# EAGLE design LCD-Micro-PC (EAGLE 6.5.0)
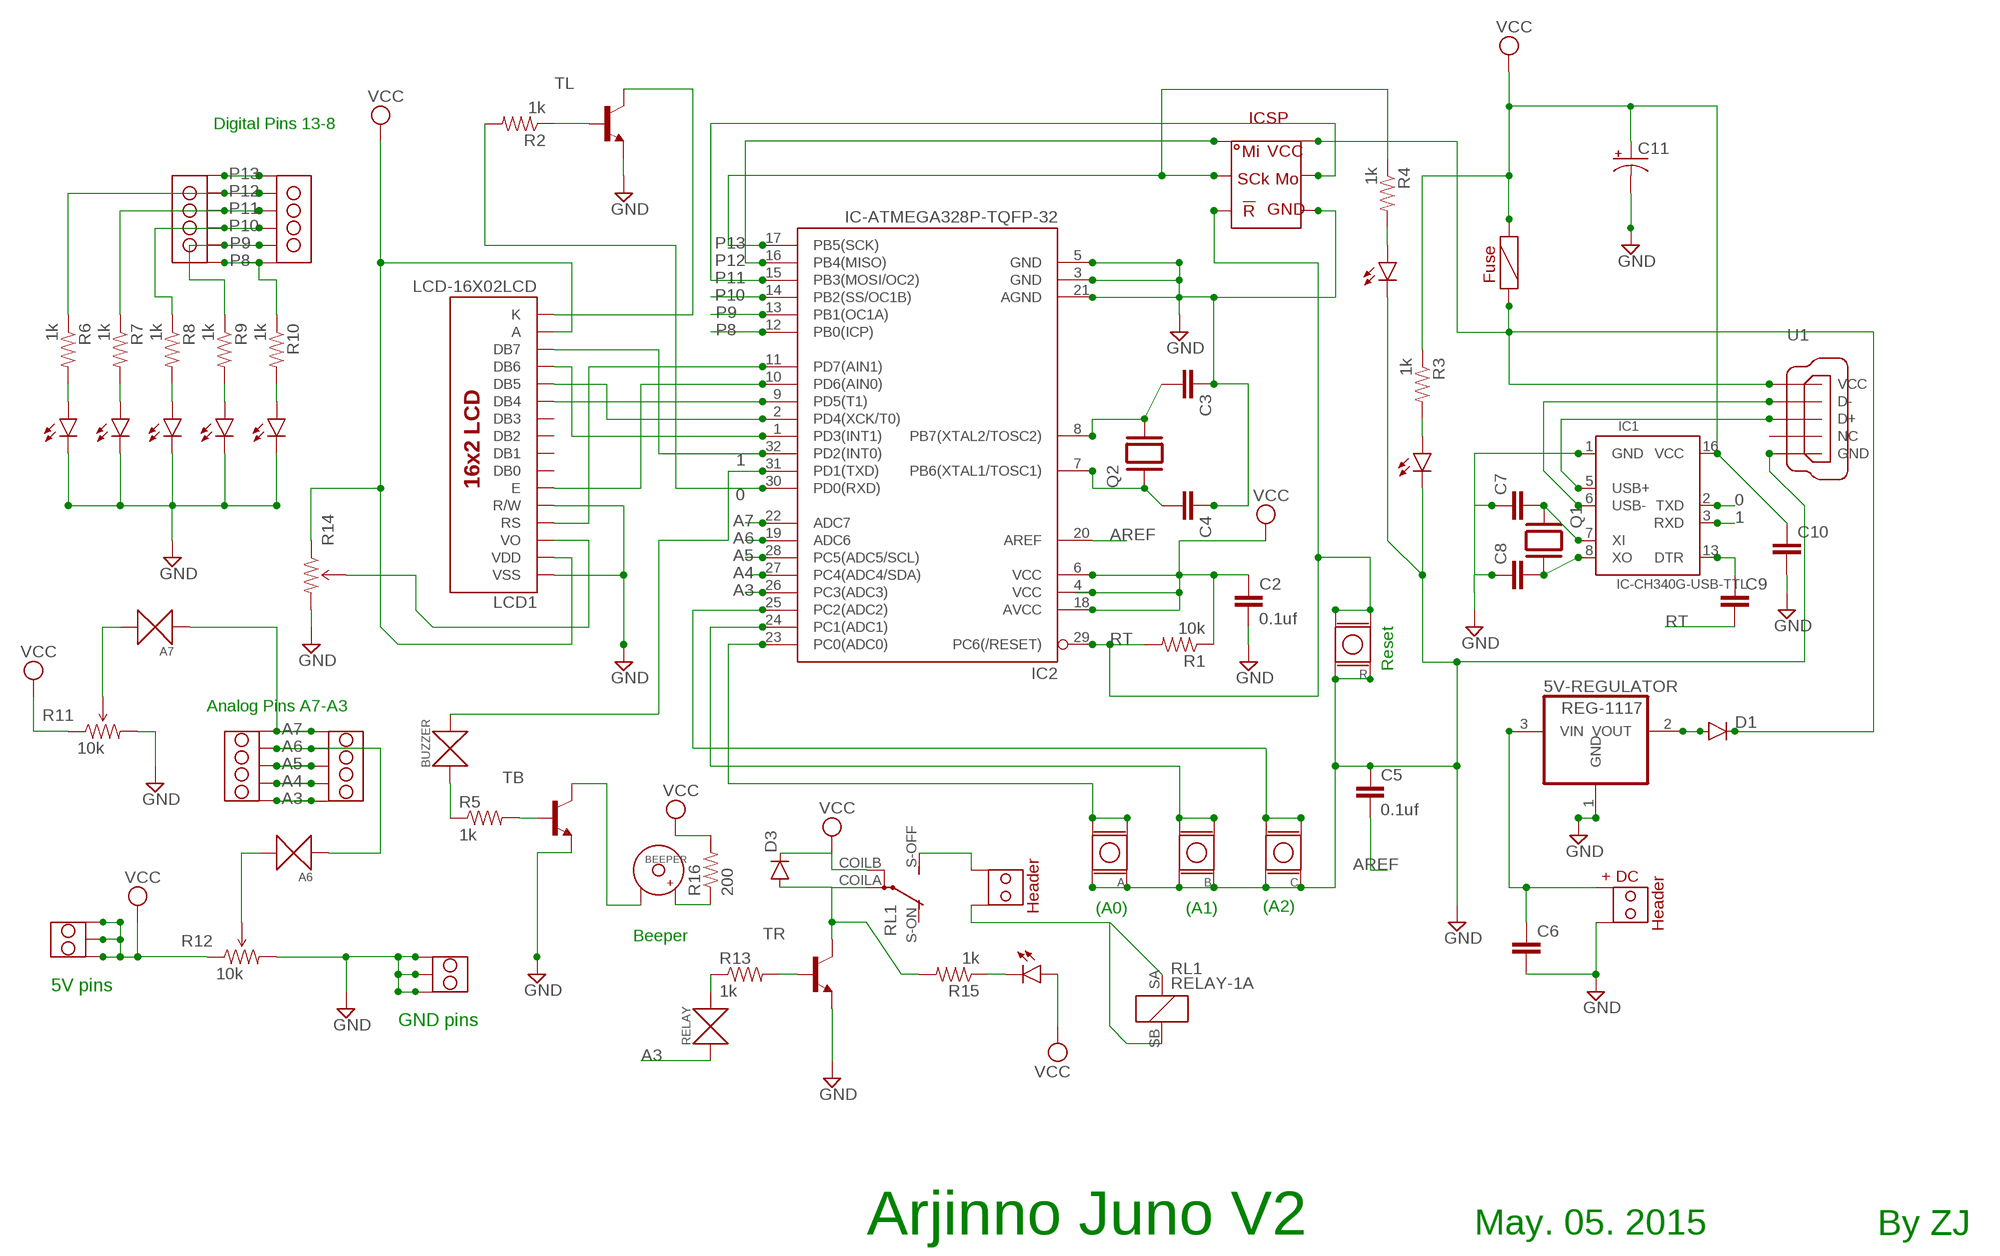
[diagram p0: schematic, sheet 1]

## Parts
5V-REGULATOR  REG-1117  [SOT-223@1]
A  BUTTON-6X6  [BUT-6X6]
A6  TRACE-0.6MM  [TRACE]
A7  TRACE-0.6MM  [TRACE]
B  BUTTON-6X6  [BUT-6X6]
BEEPER  BUZZER-12MM  [BUZ-12MM]
BUZZER  TRACE-0.6MM  [TRACE]
C  BUTTON-6X6  [BUT-6X6]
C2  0.1uf  CAP-0805  [0805]
C3  CAP-0805  [0805]
C4  CAP-0805  [0805]
C5  0.1uf  CAP-0805  [0805]
C6  CAP-0805  [0805]
C7  CAP-SMD-0805  [0805]
C8  CAP-SMD-0805  [0805]
C9  CAP-SMD-0805  [0805]
C10  CAP-SMD-0805  [0805]
C11  CAP-POL-6MM-SMD  [CAP-POL-6.3X7.7MM]
D1  DIODE-SMA-4MM  [DIODE-SMA]
D3  DIODE-SOD-1206  [SOD-1206]
FUSE  FUSE  [0805]
GND  HEADER-3P  [HEADER-3P]
H1  HEADER-2P  [HEADER-2P]
IC1  IC-CH340G-USB-TTL  [SOP-16]
IC2  IC-ATMEGA328P-TQFP-32  [TQFP32-08MM]
LCD1  LCD-16X02LCD  [LCD-1602]
LED1  LED-0805  [LED-0805]
LED3  LED-0805  [LED-0805]
LED4  LED-0805  [LED-0805]
LED6  LED-0805  [LED-0805]
LED7  LED-0805  [LED-0805]
LED8  LED-0805  [LED-0805]
LED9  LED-0805  [LED-0805]
LED10  LED-0805  [LED-0805]
Q1  CRYSTAL-5032  [CRYSTAL-5032]
Q2  CRYSTAL-5032  [CRYSTAL-5032]
R  BUTTON-4X4-SMD  [BUT-SMD-4X4]
R1  10k  RES-0805  [0805]
R2  1k  RES-0805  [0805]
R3  1k  RES-0805  [0805]
R4  1k  RES-0805  [0805]
R5  1k  RES-0805  [0805]
R6  1k  RES-0805  [0805]
R7  1k  RES-0805  [0805]
R8  1k  RES-0805  [0805]
R9  1k  RES-0805  [0805]
R10  1k  RES-0805  [0805]
R11  10k  POT-6MM-0505  [POT-5X5MM@1]
R12  10k  POT-10MM  [POT-10X10MM@1]
R13  1k  RES-0805  [0805]
R14  POTENTIOMETER-3MM-SMD  [POT-3MM-SMD]
R15  1k  RES-0805  [0805]
R16  200  RES-0805  [0805]
RELAY  TRACE-0.6MM  [TRACE]
RL1  RELAY-1A  [REL-G5V1]
TB  NPN-S8050-J3Y-0.3W  [SOT-23]
TL  NPN-S8050-J3Y-0.3W  [SOT-23]
TR  NPN-S8050-J3Y-0.3W  [SOT-23]
U1  USB-MINI  [USB-MINI]
U$1  ISCP-6PINS  [ISCP]
U$2  HEADER-2P-DC  [HEADER-2P-DC]
U$9  HEADER-5P  [HEADER-5P]
U$10  HEADER-6P  [HEADER-6P]
U$11  HEADER-6P  [HEADER-6P]
U$12  HEADER-5P  [HEADER-5P]
VCC  HEADER-3P  [HEADER-3P]

## Nets
0: IC1.2(TXD) IC2.30(PD0(RXD)) R2.2
1: BUZZER.P$2 IC1.3(RXD) IC2.31(PD1(TXD))
A3: IC2.26(PC3(ADC3)) RELAY.P$1 U$9.P$5 U$12.P$1
A4: IC2.27(PC4(ADC4/SDA)) U$9.P$4 U$12.P$2
A5: IC2.28(PC5(ADC5/SCL)) U$9.P$3 U$12.P$3
A6: A6.P$1 IC2.19(ADC6) U$9.P$2 U$12.P$4
A7: A7.P$1 IC2.22(ADC7) U$9.P$1 U$12.P$5
AREF: C5.2 IC2.20(AREF)
GND: 5V-REGULATOR.1(GND) A.B0 A.B1 B.B0 B.B1 C2.2 C3.1 C4.1 C5.1 C6.2 C7.1 C8.1 C10.2 C11.- C.B0 C.B1 GND.P$1 GND.P$2 GND.P$3 IC1.1(GND) IC2.3(GND) IC2.5(GND) IC2.21(AGND) LCD1.1(VSS) LCD1.5(R/W) LED3.C LED4.C LED6.C LED7.C LED8.C LED9.C LED10.C R11.3(CW) R12.3(CW) R14.3(CW) R.B1(B0) R.B2(B1) TB.2(E) TL.2(E) TR.2(E) U1.5(GND) U$1.P$4 U$2.-
N$1: IC2.32(PD2(INT0)) LCD1.14(DB7)
N$2: IC2.1(PD3(INT1)) LCD1.13(DB6)
N$3: IC2.2(PD4(XCK/T0)) LCD1.12(DB5)
N$4: IC2.9(PD5(T1)) LCD1.11(DB4)
N$6: LCD1.16(K) TL.3(C)
N$7: BUZZER.P$1 R5.1
N$8: R2.1 TL.1(B)
N$9: IC1.5(USB+) U1.3(D+)
N$10: LCD1.3(VO) R14.2(WIPER)
N$11: IC2.10(PD6(AIN0)) LCD1.6(E)
N$12: IC2.11(PD7(AIN1)) LCD1.4(RS)
N$13: A.A0 A.A1 IC2.23(PC0(ADC0))
N$14: B.A0 B.A1 IC2.24(PC1(ADC1))
N$15: C.A0 C.A1 IC2.25(PC2(ADC2))
N$16: LED3.A R3.2
N$17: BEEPER.- TB.3(C)
N$18: LED1.C R15.1
N$19: LED6.A R6.2
N$20: LED7.A R7.2
N$21: LED4.A R4.2
N$22: LED8.A R8.2
N$23: LED9.A R9.2
N$24: R5.2 TB.1(B)
N$25: LED10.A R10.2
N$26: C3.2 IC2.8(PB7(XTAL2/TOSC2)) Q2.2
N$27: C4.2 IC2.7(PB6(XTAL1/TOSC1)) Q2.1
N$28: 5V-REGULATOR.2(VOUT) D1.A
N$29: A7.P$2 R11.2(WIPER)
N$30: D3.A R15.2 RL1.COILA(P) TR.3(C)
N$31: 5V-REGULATOR.3(VIN) C6.1 U$2.+
N$32: H1.P$2(-) RL1.SA RL1.SB
N$33: A6.P$2 R12.2(WIPER)
N$34: H1.P$1(+) RL1.S-OFF(SW)
N$36: D1.C FUSE.1 U1.1(VCC) U$1.P$6
N$37: R13.2 TR.1(B)
N$38: IC1.6(USB-) U1.2(D-)
N$39: C7.2 IC1.7(XI) Q1.1
N$40: C8.2 IC1.8(XO) Q1.2
N$41: C9.1 IC1.13(DTR)
N$43: BEEPER.+ R16.1
N$45: R13.1 RELAY.P$2
P8: IC2.12(PB0(ICP)) R10.1 U$10.P$6 U$11.P$1
P9: IC2.13(PB1(OC1A)) R9.1 U$10.P$5 U$11.P$2
P10: IC2.14(PB2(SS/OC1B)) R8.1 U$10.P$4 U$11.P$3
P11: IC2.15(PB3(MOSI/OC2)) R7.1 U$1.P$5 U$10.P$3 U$11.P$4
P12: IC2.16(PB4(MISO)) R6.1 U$1.P$1 U$10.P$2 U$11.P$5
P13: IC2.17(PB5(SCK)) R4.1 U$1.P$2 U$10.P$1 U$11.P$6
RT: C9.2 IC2.29(PC6(/RESET)) R1.2 R.A0 R.A1 U$1.P$3
VCC: C2.1 C10.1 C11.+ D3.C FUSE.2 IC1.16(VCC) IC2.4(VCC) IC2.6(VCC) IC2.18(AVCC) LCD1.2(VDD) LCD1.15(A) LED1.A R1.1 R3.1 R11.1(CCW) R12.1(CCW) R14.1(CCW) R16.2 RL1.COILB(P) VCC.P$1 VCC.P$2 VCC.P$3
Unconnected: LCD1.7(DB0) LCD1.8(DB1) LCD1.9(DB2) LCD1.10(DB3) RL1.S-ON(ON) U1.4(NC)

## Notes on the sheet
- Digital Pins 13-8
- Reset
- Analog Pins A7-A3
- (A0) | (A1) | (A2)
- Beeper
- 5V pins
- GND pins
- Arjinno Juno V2 | May. 05. 2015 | By ZJ

## Library data of the parts
5V-REGULATOR = - Jins eagle lbr:REG-1117: 800mA and 1A Low Dropout (LDO) Positive Regulator 1.8V, 2.5V, 2.85V, 3.3V, 5V, and Adj; MPN: REG1117; OC_FARNELL: 1097566; OC_NEWARK: 14P6981
A B C R = - Jins eagle lbr:BUTTON
A6 A7 BUZZER RELAY = - Jins eagle lbr:TRACE
BEEPER = - Jins eagle lbr:BUZZER-12MM
C2-C6 = - Jins eagle lbr:CAP-0805
C7-C10 = - Jins eagle lbr:CAP-SMD
C11 = - Jins eagle lbr:CAP-POL
D1 D3 = - Jins eagle lbr:DIODE: Diode These are standard reverse protection diodes and small signal diodes. SMA package can handle up to about 1A. SOD-323 can handle about 200mA. What the SOD-323 package when ordering, there are some mfgs out there that are 5-pin packages.
FUSE = - Jins eagle lbr:FUSE
GND VCC = - Jins eagle lbr:HEADER-3P
H1 = - Jins eagle lbr:HEADER-2P
IC1 = - Jins eagle lbr:IC-CH340G
IC2 = - Jins eagle lbr:IC-ATMEGA328P-TQFP-32
LCD1 = - Jins eagle lbr:LCD-16X02
LED1 LED3 LED4 LED6-LED10 = - Jins eagle lbr:LED
Q1 Q2 = - Jins eagle lbr:CRYSTAL: CRYSTAL
R1-R10 R13 R15 R16 = - Jins eagle lbr:RES-0805
R11 = - Jins eagle lbr:POT-6MM-0505
R12 = - Jins eagle lbr:POT-10MM
R14 = - Jins eagle lbr:POTENTIOMETER
RL1 = - Jins eagle lbr:RELAY
TB TL TR = - Jins eagle lbr:NPN
U1 = - Jins eagle lbr:USB-MINI
U$1 = - Jins eagle lbr:ISCP
U$2 = - Jins eagle lbr:HEADER-2P-DC
U$9 U$12 = - Jins eagle lbr:HEADER-5P
U$10 U$11 = - Jins eagle lbr:HEADER-6P

## Board
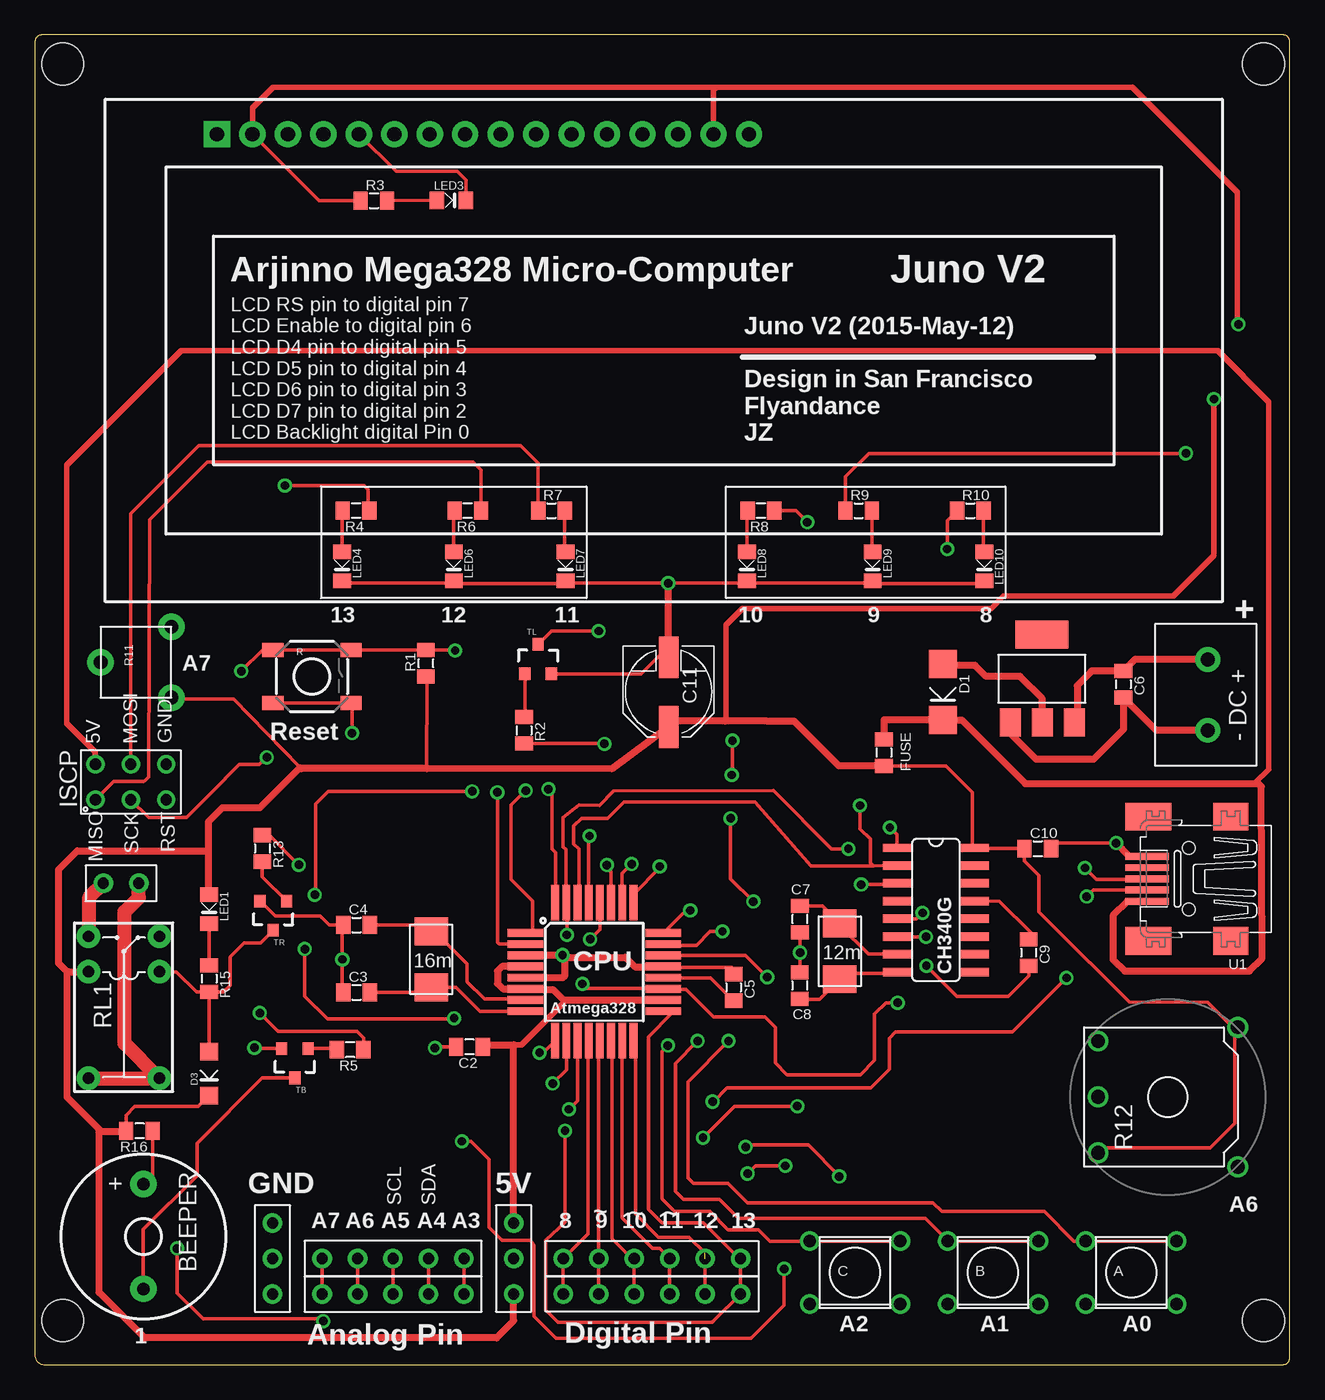
[diagram p1: board, top side]
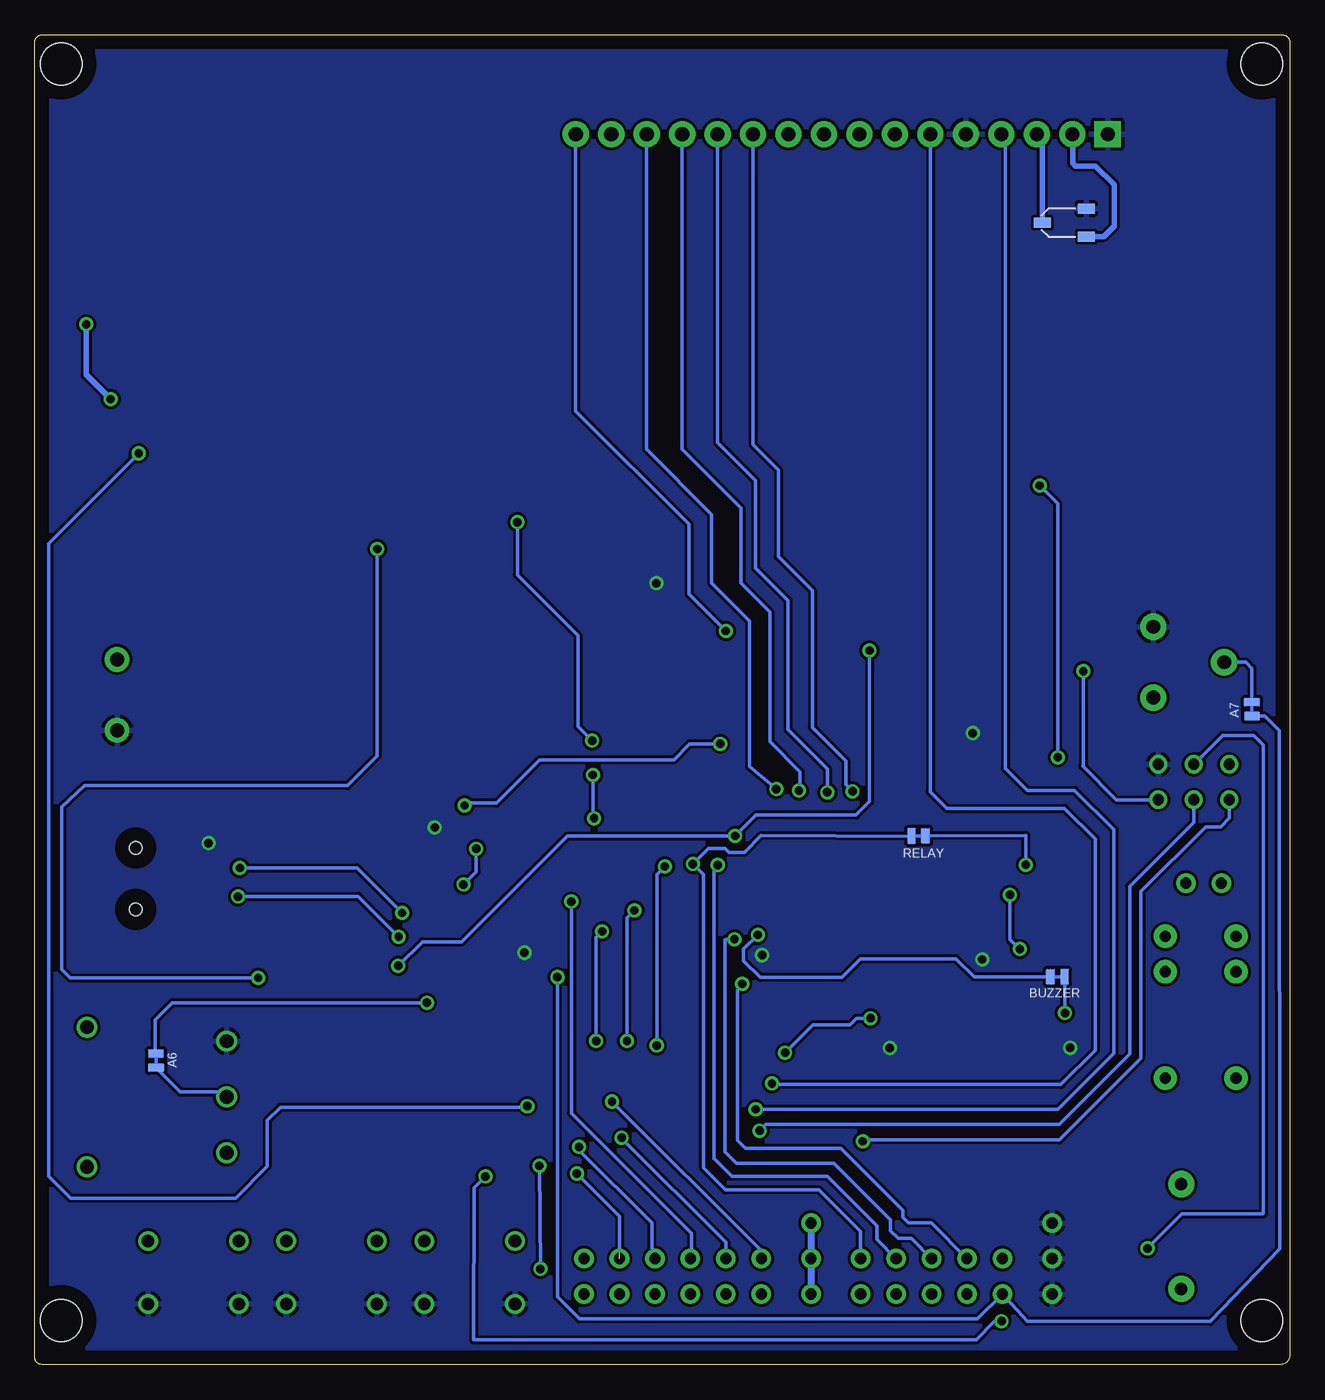
[diagram p2: board, bottom side, seen from below]

Size 89.88 x 95.24 mm. Coordinates in mm from the lower left corner, seen from the top.
Outline: 0,0.67 arc98 0.76,0.01 89.41,0.01 arc90 89.88,0.48 89.88,94.77 arc90 89.41,95.24 0.51,95.24 arc90 0,94.73 0,0.67
Copper layers (1*16): Top 0.035mm / dielectric 1.5mm / Bottom 0.035mm
Design rules "default *": minimum track width 10mil, minimum drill 24mil, track to track 8mil, track to pad 8mil, pad to pad 8mil, via to via 8mil, smd to smd 8mil, copper to edge 40mil, drill to drill 8mil, minimum pad ring 10mil, minimum via ring 8mil, stop-mask expansion 4mil, vias tented up to drill 0.62mm, thermal gap 10mil
Holes 3 mm at 2,93.16 88,93.16 2,3.16 88,3.16

### Footprints (pad centres in the part's own frame; a part is rotated, then mirrored left to right if it is on the bottom)
SOT-223@1 = smd 1.499 x 2.007: 1 -2.261,-3.15; 2 0.025,-3.15; 3 2.311,-3.15 | smd 3.81 x 2.007: 4 0,3.15
BUT-6X6 = drill 0.9: A0 -3.25,2.25; A1 3.25,2.25; B0 -3.25,-2.25; B1 3.25,-2.25
TRACE = smd 0.508 x 1.016: P$1 -0.508,-0.025; P$2 0.508,0
BUZ-12MM = drill 0.9 pad 1.88: + 3.75,0; - -3.75,0
0805 = smd 1.016 x 1.27: 1 -0.95,0; 2 0.95,0
CAP-POL-6.3X7.7MM = smd 3 x 1.4: + 2,0; - -3,0
DIODE-SMA = smd 2 x 2: A -2,0; C 2,0
SOD-1206 = smd 1.27 x 1.27: A 1.575,0; C -1.575,0
HEADER-3P = drill 0.8 pad 1.4: P$1 0,2.54; P$2 0,0; P$3 0,-2.54
HEADER-2P = drill 0.8 pad 1.4: P$1 0,1.27; P$2 0,-1.27
SOP-16 = smd 0.6 x 2: 1 -3.945,-2.76; 2 -2.675,-2.76; 3 -1.405,-2.76; 4 -0.135,-2.76; 5 1.135,-2.76; 6 2.405,-2.76; 7 3.675,-2.76; 8 4.945,-2.76; 9 4.945,2.84; 10 3.675,2.84; 11 2.405,2.84; 12 1.135,2.84; 13 -0.135,2.84; 14 -1.405,2.84; 15 -2.675,2.84; 16 -3.945,2.84
TQFP32-08MM = smd 2.54 x 0.559: 1 -6.502,6.75; 2 -6.502,5.95; 3 -6.502,5.15; 4 -6.502,4.35; 5 -6.502,3.55; 6 -6.502,2.75; 7 -6.502,1.95; 8 -6.502,1.15; 17 3.404,1.15; 18 3.404,1.95; 19 3.404,2.75; 20 3.404,3.55; 21 3.404,4.35; 22 3.404,5.15; 23 3.404,5.95; 24 3.404,6.75 | smd 0.559 x 2.54: 9 -4.35,-0.965; 10 -3.55,-0.965; 11 -2.75,-0.965; 12 -1.95,-0.965; 13 -1.15,-0.965; 14 -0.35,-0.965; 15 0.45,-0.965; 16 1.25,-0.965; 25 1.25,8.915; 26 0.45,8.915; 27 -0.35,8.915; 28 -1.15,8.915; 29 -1.95,8.915; 30 -2.75,8.915; 31 -3.55,8.915; 32 -4.35,8.915
LCD-1602 = drill 1.016 pad 1.88 square: 1 -29.46,14.23 | drill 1.016 pad 1.88: 2 -26.92,14.23; 3 -24.38,14.23; 4 -21.84,14.23; 5 -19.3,14.23; 6 -16.76,14.23; 7 -14.22,14.23; 8 -11.68,14.23; 9 -9.14,14.23; 10 -6.6,14.23; 11 -4.06,14.23; 12 -1.52,14.23; 13 1.02,14.23; 14 3.56,14.23; 15 6.1,14.23; 16 8.64,14.23
LED-0805 = smd 1.016 x 1.27: A -1.052,0; C 1.026,0
CRYSTAL-5032 = smd 2 x 2.4: 1 -2,0; 2 2,0
BUT-SMD-4X4 = smd 1.524 x 1.016: A0 -2.794,1.905; A1 2.794,1.905; B1 -2.794,-1.905; B2 2.794,-1.905
POT-5X5MM@1 = drill 1 pad 1.88: 1 -3.81,0.54; 2 -1.27,5.62; 3 1.27,0.54
POT-10X10MM@1 = drill 0.991: 1 -4,5; 2 0,5; 3 4,5; P$4 -5,-5; P$5 5,-5
POT-3MM-SMD = smd 0.7 x 1.2: 1 -1,-1.55; 2 0,1.6; 3 1,-1.55
REL-G5V1 = drill 0.813 pad 1.676: COILA -2.54,2.54; COILB -2.54,-2.54; S-OFF -5.08,-2.54; S-ON -5.08,2.54; SA 5.08,2.54; SB 5.08,-2.54
SOT-23 = smd 0.8 x 0.9: 1 -1.315,-0.635; 2 0.585,-0.635; 3 -0.365,1.465
USB-MINI = smd 3.1 x 0.5: 1 4.27,1.6; 2 4.27,0.8; 3 4.27,0; 4 4.27,-0.8; 5 4.27,-1.6 | smd 2.5 x 2: M1 -1.73,-4.45; M2 -1.73,4.45 | smd 3.3 x 2: M3 4.17,4.45; M4 4.17,-4.45 | hole 0.9: 1.27,2.2; 1.27,-2.2
ISCP = drill 0.8: P$1 -2.54,2.54; P$2 -2.54,0; P$3 -2.54,-2.54; P$4 0,-2.54; P$5 0,0; P$6 0,2.54
HEADER-2P-DC = drill 1 pad 1.778: + 0,2.54; - 0,-2.54
HEADER-5P = drill 0.8 pad 1.4: P$1 0,5.08; P$2 0,2.54; P$3 0,0; P$4 0,-2.54; P$5 0,-5.08
HEADER-6P = drill 0.8 pad 1.4: P$1 0,2.54; P$2 0,0; P$3 0,-2.54; P$4 0,-5.08; P$5 0,-7.62; P$6 0,-10.16

### Placement (x,y rotation side)
5V-REGULATOR  72.13,49.13 0 top
A  78.52,6.59 0 top
A6  81.2,21.77 270 bottom
A7  2.71,46.95 90 bottom
B  68.63,6.59 0 top
BEEPER  7.77,9.17 90 top
BUZZER  16.64,27.78 180 bottom
C  58.74,6.59 0 top
C2  31.13,22.75 180 top
C3  23.04,26.66 0 top
C4  23.04,31.49 0 top
C5  50.05,27.01 270 top
C6  77.96,48.73 270 top
C7  54.8,31.91 90 top
C8  54.78,27.15 270 top
C9  71.18,29.5 270 top
C10  71.83,36.96 0 top
C11  45.39,47.67 270 top
D1  65.03,48.17 270 top
D3  12.48,20.84 90 top
FUSE  60.82,43.83 270 top
GND  17.02,7.59 0 top
H1  6.17,34.48 90 top
IC1  64.49,33.06 270 top
IC2  41.62,24.16 0 top
LCD1  42.5,73.9 0 top
LED1  12.48,32.61 270 top
LED3  29.85,83.39 0 top
LED4  22,57.16 270 top
LED6  30,57.16 270 top
LED7  38,57.16 270 top
LED8  51,57.16 270 top
LED9  60,57.16 270 top
LED10  68,57.16 270 top
Q1  57.66,29.61 270 top
Q2  28.39,29.02 270 top
R  19.85,49.28 0 top
R1  28.01,50.23 90 top
R2  35.04,45.43 270 top
R3  24.28,83.36 0 top
R4  23,61.16 180 top
R5  22.58,22.56 180 top
R6  31,61.16 180 top
R7  37,61.16 0 top
R8  52,61.16 180 top
R9  59,61.16 0 top
R10  67,61.16 0 top
R11  10.32,51.58 90 top
R12  81.15,19.17 90 top
R13  16.29,36.97 270 top
R14  16.13,81.8 90 bottom
R15  12.48,27.64 270 top
R16  7.49,16.74 180 top
RELAY  26.59,37.87 0 bottom
RL1  6.38,25.59 270 top
TB  18.26,22 180 top
TL  36.41,50.12 0 top
TR  16.71,32.57 180 top
U1  83.92,34.79 180 top
U$1  6.87,43 90 top
U$2  84,47.97 0 top
U$9  25.65,5.05 90 top
U$10  48.01,7.59 270 top
U$11  40.39,5.05 90 top
U$12  25.65,7.59 270 top
VCC  34.29,7.59 0 top

### Tracks (layer width: path | path; a pad name or v marks a point on that pad's centre or on a via)
0  (via drill 0.6)
  Top 0.254: 61.49,35.78 IC1.2 60.05,35.73 | IC2.30 38.96,33.18 38.96,36.92 38.58,37.3 38.58,38.57 39.14,39.13 41.02,39.13 42.19,40.3 51.56,40.3 55.6,35.73 60.05,35.73 | R2.2 40.78,44.48 v40.79,44.46 | v59.11,40.05 59.11,38.37 59.84,37.63 59.84,35.93 60.05,35.73
  Bottom 0.254: v40.79,44.46 42.98,44.46 44.12,43.32 53.72,43.32 56.82,40.22 58.93,40.22 v59.11,40.05
1  (via drill 0.6)
  Top 0.254: IC1.3 61.46,34.38 v59.18,34.38 | 38.05,32.83 38.05,36.9 37.82,37.07 37.82,39.18 38.96,40.07 40.44,40.05 41.43,41.09 52.88,41.11 57.05,36.95 v58.27,36.95 | 38.05,32.83 38.05,32.53 38.15,32.43 38.1,32.37 v38.1,30.77 | IC2.31 38.07,32.85 38.05,32.83
  Bottom 0.254: v59.18,34.38 58.27,35.3 v58.27,36.95 | v38.1,30.77 39.12,29.76 39.12,28.92 37.92,27.73 32.08,27.73 30.73,29.07 23.9,29.07 22.61,27.78 BUZZER.P$2
A3  (via drill 0.6)
  Top 0.254: U$9.P$5 U$12.P$1 | v42.75,35.85 42.07,35.17 IC2.26
  Bottom 0.254: U$12.P$1 30.73,9.54 33.71,12.51 40.41,12.51 41.99,14.09 41.99,35.09 v42.75,35.85 41.63,36.97 40.46,36.97 40.18,36.69 39.06,36.69 37.86,37.9 RELAY.P$1
A4  (via drill 0.6)
  Top 0.254: U$9.P$4 U$12.P$2 | v40.97,35.78 41.15,35.35 41.22,35.35 41.27,35.3 IC2.27
  Bottom 0.254: U$12.P$2 29.57,8.97 29.57,9.95 33.12,13.5 39.95,13.5 41.12,14.67 41.15,14.67 41.22,14.75 41.22,35.42 40.89,35.75 v40.97,35.78
A5  (via drill 0.6)
  Top 0.254: U$9.P$3 U$12.P$3 | v39.78,30.47 40.47,31.16 IC2.28
  Bottom 0.254: U$12.P$3 27.09,9.03 28.04,9.03 28.6,9.59 28.6,10.35 32.66,14.42 39.62,14.42 40.44,15.23 40.44,30.42 40.39,30.47 v39.78,30.47
A6  (via drill 0.6)
  Top 0.254: U$9.P$2 U$12.P$4 | v39.22,27.27 39.55,26.94 44.5,26.94 44.52,26.91 IC2.19 45.07,26.86 46.63,26.86 48.59,24.91 52.3,24.91 53.03,24.17 53.03,21.6 53.87,20.77 59.13,20.77 60.15,21.78 60.15,25.11 60.96,25.92 v61.8,25.92
  Bottom 0.254: U$12.P$4 25.67,10.15 27.3,10.15 27.71,10.56 27.71,11.04 32.16,15.48 38.99,15.48 39.57,16.07 39.57,26.81 39.22,27.17 v39.22,27.27 | v61.8,25.92 80.03,25.92 81.28,24.68 81.28,23.84 81.28,23.33 81.28,22.33 A6.P$1
A7  (via drill 0.6)
  Top 0.254: v52.45,27.75 50.89,29.31 IC2.22 | U$9.P$1 U$12.P$5
  Bottom 0.254: v52.45,27.75 52.45,4.84 50.88,3.27 22.36,3.27 U$9.P$1 20.24,4.71 18.8,3.09 5.71,3.09 0.71,8.29 0.76,45.18 0.76,45.4 1.8,46.45 A7.P$1
AREF
  Top 0.254: C5.2 48.4,27.71 IC2.20
GND  (via drill 0.6)
  Top 0.254: v77.44,37.35 73.18,37.35 C10.2 | 50.83,55.97 v45.36,55.97 38.48,55.97 | 50.83,55.97 LED8.C | 50.83,55.97 50.9,55.97 50.93,56 59.86,56 | 59.86,56 LED9.C | LED9.C 60,56.12 60.12,56 | 60.12,56 59.86,56 | 60.12,56 60.4,56 60.45,55.95 67.81,55.95 LED10.C | 38.48,55.97 38.17,55.97 LED7.C | 38.48,55.97 38.46,55.95 30.33,55.95 30.14,56.14 LED6.C 29.66,56.14 29.52,56 22.14,56 LED4.C | 60.22,55.91 LED9.C | TL.2 43.42,49.48 45.39,51.45 | R.B1 R.B2 22.71,47.31 v22.71,45.23 | 37.78,29.31 v37.8,29.33 37.92,29.2 37.95,29.17 | 37.92,27.8 37.82,27.7 | 35.94,27.7 35.93,27.71 IC2.5 | 43.94,28.49 43.97,28.51 IC2.21 45.07,28.46 49.94,28.46 50.05,28.35 C5.1 | C3.1 22.02,26.73 v22.02,29.02 22.02,31.42 C4.1 21.08,31.49 20.45,32.12 17.2,32.12 TR.2 | v28.65,22.67 28.73,22.75 C2.2 | 15.74,22.68 v15.72,22.7 15.79,22.63 TB.2 | LED3.C 30.87,84.84 30.25,85.46 25.87,85.46 LCD1.5 | C7.1 54.81,30.95 v54.81,29.5 54.81,28.14 C8.1 | IC1.1 61.73,37.98 v61.24,38.47
  Top 0.508: U$2.- 80.31,45.43 C6.2 77.96,45.49 75.82,43.35 71.73,43.35 69.98,45.1 69.98,45.87 5V-REGULATOR.1 | U1.5 78.41,36.39 v77.44,37.35 | C11.- 45.39,51.45 45.39,55.95 v45.36,55.97 | 37.78,29.31 IC2.3 | 37.92,29.2 37.92,27.8 | 37.82,27.7 35.94,27.7 | 37.95,29.17 42.29,29.17 42.98,28.49 43.94,28.49
  pour Bottom: 90.6,95.82 90.6,0.45 -0.51,0.45 -0.51,1.46 -0.33,1.46 -0.33,95.82
N$1  (via drill 0.6)
  Top 0.254: IC2.32 37.39,33.2 37.39,33.95 37.29,33.44 37.29,36.67 37.03,36.92 37.03,40.96 v36.78,41.21
  Bottom 0.254: LCD1.14 46.06,65.56 41.4,60.9 41.4,55.97 38.68,53.25 38.68,42.84 v36.78,41.21
N$2  (via drill 0.6)
  Top 0.254: IC2.1 35.15,30.95 34.62,30.95 34.54,30.88 35.46,30.88 35.64,31.05 35.64,33.21 34.11,34.74 34.11,40.07 v35.15,41.11
  Bottom 0.254: LCD1.13 43.52,65.56 39.32,61.36 39.32,55.97 37.24,53.89 37.24,44.62 35.08,42.46 35.08,41.19 v35.15,41.11
N$3  (via drill 0.6)
  Top 0.254: 35.04,30.04 IC2.2 33.25,30.11 33.12,30.24 v33.12,40.99
  Bottom 0.254: LCD1.12 40.98,66.04 38.25,63.31 38.25,57.04 35.94,54.73 35.94,45.48 33.12,42.66 v33.12,40.99
N$4  (via drill 0.6)
  Top 0.254: v19.33,29.76 19.33,26.38 20.95,24.75 29.97,24.75 v30.02,24.81 | v36.14,22.34 36.41,22.34 IC2.9 | v31.32,41.06 21.01,41.06 20.09,40.15 20.09,33.7 v20.04,33.64
  Bottom 0.254: LCD1.11 38.44,65.89 36.63,64.07 36.63,57.88 34.19,55.44 34.19,45.63 31.8,43.25 31.8,41.54 v31.32,41.06 | v20.04,33.64 20.04,30.47 v19.33,29.76 | v30.02,24.81 31.04,24.81 31.5,24.35 34.14,24.35 v36.14,22.34
N$6  (via drill 0.6)
  Top 0.254: v40.39,52.54 37,52.54 TL.3
  Bottom 0.254: LCD1.16 51.14,68.3 43.03,60.19 43.03,55.18 v40.39,52.54
N$7  (via drill 0.6)
  Top 0.254: R5.1 23.53,23.4 23.06,23.87 17.42,23.87 v16.1,25.19
  Bottom 0.254: v16.1,25.19 16.1,27.78 BUZZER.P$1
N$8
  Top 0.254: TL.1 35.09,46.43
  Top 0.381: 35.09,46.43 R2.1
N$9  (via drill 0.6)
  Top 0.254: U1.3 79.65,34.76 76.02,34.76 v75.21,35.57 | v63.58,32.35 63.15,31.92 IC1.5
  Bottom 0.254: v75.21,35.57 66.8,35.57 v63.58,32.35
N$10
  Bottom 0.381: R14.2 17.73,87.74 LCD1.3
N$11  (via drill 0.6)
  Top 0.254: v37.08,20.13 38.07,21.11 IC2.10
  Bottom 0.254: LCD1.6 25.74,41.02 24.56,39.84 16.13,39.84 13.92,37.63 13.92,22.52 16.38,20.06 37.01,20.06 v37.08,20.13
N$12  (via drill 0.6)
  Top 0.254: v38.25,18.28 38.87,18.89 IC2.11
  Bottom 0.254: LCD1.4 20.37,87.84 20.37,42.71 18.8,41.14 15.42,41.14 12.6,38.32 12.6,22.29 16.61,18.28 v38.25,18.28
N$13  (via drill 0.6)
  Top 0.254: A.A1 A.A0 74.41,8.84 72.29,10.96 64.97,10.96 64.34,11.6 51.03,11.6 49.66,12.97 47.17,12.97 46.76,13.38 46.76,20.26 v49.68,23.18 | v49.25,31.03 48.36,31.03 47.37,30.04 45.1,30.04 IC2.23
  Bottom 0.254: v49.68,23.18 49.68,30.6 v49.25,31.03
N$14  (via drill 0.6)
  Top 0.254: B.A1 B.A0 65.38,8.88 63.78,10.48 50.39,10.48 49.05,11.83 46.46,11.83 45.87,12.41 45.87,21.58 v47.47,23.18 | v46.94,32.53 46.63,32.53 IC2.24
  Bottom 0.254: v47.47,23.18 47.47,31.99 v46.94,32.53
N$15  (via drill 0.6)
  Top 0.254: C.A1 C.A0 52.64,8.84 51.82,9.67 49.63,9.67 48.34,10.96 45.82,10.96 44.91,11.88 44.91,22.42 v45.34,22.85 | v44.76,35.68 44.76,35.57 42.9,33.72 42.9,33.11 IC2.25
  Bottom 0.254: v45.34,22.85 45.34,35.09 v44.76,35.68
N$16
  Top 0.254: R3.2 LED3.A
N$17
  Top 0.254: BEEPER.- 7.77,9.69 11.61,13.53 11.61,15.86 16.28,20.53 TB.3
N$18
  Top 0.254: LED1.C 12.55,31.51 12.55,31.36 12.48,31.29 R15.1
N$19
  Top 0.254: LED6.A 30,61.11 R6.2
N$20
  Top 0.254: R7.2 37.95,58.27 LED7.A
N$21
  Top 0.254: LED4.A 22,61.11 R4.2
N$22
  Top 0.254: LED8.A 51,61.11 R8.2
N$23
  Top 0.254: R9.2 59.95,58.27 LED9.A
N$24
  Top 0.254: TB.1 21.56,22.63 R5.2
N$25
  Top 0.254: R10.2 67.95,58.27 LED10.A
N$26
  Top 0.254: IC2.8 31.88,25.31 30.17,27.02 Q2.2 28.02,26.66 C3.2
N$27
  Top 0.254: IC2.7 34.01,26.05 arc90 33.88,26.18 32.21,26.18 30.96,27.42 30.96,28.69 28.63,31.02 Q2.1 28.39,30.6 27.79,31.49 C4.2
N$28
  Top 0.508: 5V-REGULATOR.2 72.15,47.7 70.56,49.29 68.12,49.29 67.33,50.08 65.13,50.08 D1.A
N$29
  Bottom 0.254: R11.2 3.15,50.31 2.72,49.88 2.72,49.22 A7.P$2
N$30
  Top 0.254: 12.66,26.69 R15.2 | R15.2 | R15.2 11.58,26.68 10.13,28.13 RL1.COILA | R15.2 12.57,26.58 12.57,26.51 12.48,26.41 D3.A | TR.3 16.18,30.22 14.99,30.22 13.97,29.2 13.97,27.17 13.5,26.69 R15.2
N$31
  Top 0.508: U$2.+ 78.79,50.51 C6.1 75.7,49.68 74.65,48.63 74.65,46.19 5V-REGULATOR.3
N$32
  Top 1.016: H1.P$2 7.44,33.44 6.43,32.43 6.43,23 RL1.SA RL1.SB
N$33
  Bottom 0.254: A6.P$2 79.46,19.52 76.51,19.52 R12.2
N$34
  Top 1.016: H1.P$1 3.91,33.49 3.91,30.74 RL1.S-OFF
N$36
  Top 0.381: U$1.P$6 4.33,43.87 2.29,45.91 2.29,64.43 10.46,72.61 84.71,72.61 88.37,68.95 88.37,42.64 87.35,41.62
  Top 0.508: FUSE.1 60.81,46.17 D1.C 65.06,46.14 66.42,46.14 70.94,41.62 87.35,41.62 87.63,41.62 87.86,41.39 87.91,29.1 87,28.18 78.05,28.18 77.22,29.02 77.22,32.17 78.24,33.19 U1.1
N$37
  Top 0.254: TR.1 16.29,34.93 R13.2
N$38  (via drill 0.6)
  Top 0.254: v63.83,30.65 61.55,30.65 IC1.6 | U1.2 75.81,33.99 v75.34,33.52
  Bottom 0.254: v75.34,33.52 66.73,33.54 v63.83,30.65
N$39
  Top 0.254: IC1.7 61.52,29.4 59.69,29.4 57.66,31.43 Q1.1 56.41,32.86 C7.2
N$40
  Top 0.254: C8.2 54.83,26.15 56.2,26.15 Q1.2 57.66,27.68 57.96,27.98 57.96,28.03 61.46,28.03 IC1.8
N$41
  Top 0.254: IC1.13 69.08,33.19 71.32,30.95 71.32,30.6 C9.1
N$43
  Top 0.254: R16.1 8.44,13.6 BEEPER.+
N$45  (via drill 0.6)
  Top 0.254: R13.1 16.78,37.92 v18.9,35.8
  Bottom 0.254: v18.9,35.8 18.9,37.9 RELAY.P$2
P8  (via drill 0.6)
  Top 0.254: U$11.P$1 U$10.P$6 39.62,9.37 39.62,22.09 39.67,22.13 IC2.12 | R10.1 65.35,60.47 v65.35,58.41 | v73.89,27.7 70,23.81 61.65,23.81 61.19,23.36 61.19,21.15 59.87,19.83 49.58,19.83 48.59,18.84 v48.54,18.84
  Bottom 0.254: v65.35,58.41 65.35,43.6 67.49,41.47 86.31,41.47 87.96,39.94 87.96,28.31 87.35,27.7 v73.89,27.7 | v48.54,18.84 37.85,8.14 U$10.P$6
P9  (via drill 0.6)
  Top 0.254: U$11.P$2 U$10.P$5 40.39,23.12 IC2.13 | R9.1 58.06,61.18 58.06,63.59 59.74,65.27 v82.45,65.27 | v54.61,18.51 50.11,18.51 v47.85,16.25
  Bottom 0.254: 54.51,18.4 v54.61,18.51 54.69,18.43 72.29,18.43 73.23,17.49 73.23,14.2 75.51,11.92 87.32,11.92 88.9,13.5 88.9,58.79 82.45,65.24 v82.45,65.27 | v47.85,16.25 47.85,16.22 40.39,8.75 U$10.P$5
P10  (via drill 0.6)
  Top 0.254: U$11.P$3 U$10.P$4 42.76,7.59 41.35,9.01 41.35,23.11 IC2.14 | R8.1 54.5,61.16 v55.32,60.34 | v49.96,44.69 49.96,42.28 v49.91,42.23 | v49.84,39.13 49.84,34.79 v51.46,33.16
  Bottom 0.254: v55.32,60.34 55.32,56.56 50.98,52.21 50.98,45.71 v49.96,44.69 | v49.91,42.23 49.91,39.21 v49.84,39.13 | v51.46,33.16 51.46,18 42.85,9.39 42.85,7.67 U$10.P$4
P11  (via drill 0.6)
  Top 0.254: U$11.P$4 U$10.P$3 44.74,8.32 44.25,8.32 42.07,10.5 IC2.15 | 42.06,23.76 42.04,23.79 | R7.1 36.05,64.57 34.8,65.83 11.73,65.83 6.87,60.96 U$1.P$5 | v50.9,15.59 51.05,15.74 55.4,15.74 57.61,13.53 v57.61,13.48 | v20.65,3.11 20.45,3.27 12.04,3.27 10.19,5.12 v10.19,8.32
  Top 0.406: IC2.15 42.06,23.76
  Bottom 0.254: U$1.P$5 4.79,45.07 2.56,45.07 1.88,44.39 1.88,10.84 1.93,10.78 7.72,10.78 v10.19,8.32 | v50.9,15.59 50.9,15.36 45.7,10.15 45.7,7.82 U$10.P$3 | v57.61,13.48 58.42,12.66 58.45,1.82 | 58.45,1.89 58.45,1.82 | 58.45,1.82 58.45,1.77 22.45,1.77 21.16,3.11 v20.65,3.11
P12  (via drill 0.6)  (1 unrouted)
  Top 0.254: U$11.P$5 48.01,7.99 46.86,9.13 44.68,9.13 43.03,10.78 43.03,22.09 42.85,22.27 42.85,23.18 IC2.16 | R6.1 31.95,64.08 31.37,64.66 12.34,64.66 8.23,60.54 8.15,42.1 7.9,41.85 7.8,41.77 5.65,41.77 U$1.P$1 | v30.58,15.99 31.24,15.99 32.54,14.7 32.54,9.84 33.48,8.9 35.51,8.9 35.76,8.55 35.76,3.44 37.31,1.89 51.28,1.89 53.65,4.26 53.65,6.82 v53.67,6.85 | v51.05,13.68 51.61,14.24 v53.75,14.24
  Bottom 0.254: 4.33,40.21 U$1.P$1 4.33,39.14 4.95,38.52 6.02,38.52 10.67,33.87 10.67,21.94 16.51,16.09 30.48,16.09 v30.58,15.99 | v53.67,6.85 v53.75,14.24 | v51.05,13.68 48.01,10.63 U$10.P$2
P13  (via drill 0.6)
  Top 0.254: IC2.17 | 43.94,25.31 43.99,25.36 44.97,25.36 IC2.17 | v16.61,43.5 16.08,42.97 14.63,42.97 13.64,41.98 13.64,41.95 10.87,39.18 8.15,39.18 U$1.P$2 | v17.91,62.96 23.57,62.96 23.85,62.68 23.85,61.26 R4.1 | v37.97,16.75 37.97,10.17 36.58,8.9 36.58,3.9 36.6,3.9 37.47,3.04 48.54,3.04 48.62,3.11 48.62,3.12 U$11.P$6 U$10.P$1 50.46,7.59 47.9,10.15 44.91,10.15 43.94,11.11 43.94,23.48 45.67,25.21 45.12,25.21 IC2.17
  Bottom 0.254: v16.61,43.5 16.61,61.66 v17.91,62.96 | U$1.P$2 6.87,38.84 11.46,34.25 11.46,22.24 16.48,17.21 37.52,17.21 v37.97,16.75
RT  (via drill 0.6)
  Top 0.254: C9.2 71.18,27.84 69.72,26.38 66.04,26.38 v63.86,28.56 | v39.73,37.86 39.67,37.8 IC2.29 | v30.1,51.15 30.06,51.18 R1.2 22.65,51.18 R.A1 R.A0 16.3,51.19 v14.78,49.67
  Bottom 0.254: v63.86,28.56 62.13,30.29 59.31,30.29 51.74,37.86 v39.73,37.86 38.23,39.36 31.06,39.36 30.1,40.32 v30.1,51.15 | v14.78,49.67 14.78,42.92 14.83,42.86 12.42,40.45 U$1.P$3
VCC  (via drill 0.6)
  Top 0.254: FUSE.2 65.26,42.88 67.16,40.99 67.16,37.02 IC1.16 67.19,36.96 C10.1 70.88,36.07 71.91,35.04 71.91,32.43 75.49,28.84 75.59,28.77 78.38,25.97 84,25.95 85.93,24.02 85.93,17.26 84.18,15.51 76.49,15.51 R12.1 | 45.8,46.08 C11.+ | 52.35,46.18 52.45,46.08 | R1.1 28.02,49.27 28.02,49.04 28.09,48.96 28.07,42.69 | R11.1 9.88,47.67 14.22,47.67 18.98,42.79 | 18.98,42.79 19.07,42.69 | IC2.6 36.3,26.91 36.35,26.86 | C2.1 32.22,22.9 | 37.86,25.91 37.86,26.11 | LED1.A 12.45,33.69 | 2.29,28.13 2.44,28.13 | 6.5,16.7 R16.2 6.54,17.86 7.16,18.48 11.69,18.48 D3.C | 34.14,26.91 IC2.6 | IC2.6 | R3.1 20.35,83.36 LCD1.2 | 19,42.76 19,42.77 18.98,42.79
  Top 0.381: LCD1.2 15.58,90.02 17.07,91.51 48.84,91.51 | 48.84,91.51 78.59,91.51 86.13,83.96 86.13,74.59 v86.21,74.51 | v84.45,69.15 84.45,57.95 81.53,55.03 69.37,55.03 68.5,54.17 50.7,54.17 49.51,52.97 49.51,46.13 49.45,46.08 | LCD1.15 48.6,91.26 48.84,91.51 | 34.31,22.9 34.85,22.9 37.86,25.91
  Top 0.508: FUSE.2 57.57,42.88 54.37,46.08 52.45,46.08 49.45,46.08 45.8,46.08 | C11.+ 41.32,42.66 28.07,42.69 19.07,42.69 | IC2.4 33.45,28.51 33.12,28.18 33.12,27.29 33.53,26.91 34.14,26.91 | 36.35,26.86 37.11,26.86 37.86,26.11 IC2.18 | 32.22,22.9 34.31,22.9 34.29,22.87 VCC.P$1 | 12.45,33.69 12.45,36.87 | 12.45,36.87 12.45,38.9 13.44,39.89 16.13,39.89 19,42.76 | 12.45,36.87 12.37,36.79 3.05,36.79 1.7,35.45 1.7,28.74 2.32,28.13 2.44,28.13 RL1.COILB | 2.29,28.13 2.29,19.17 4.61,16.84 | 4.61,16.84 4.75,16.7 6.5,16.7 | 4.61,16.84 4.6,16.83 4.6,5.17 7.85,1.92 33.07,1.92 34.29,3.14 VCC.P$3
  Bottom 0.381: v86.21,74.51 86.21,70.91 v84.45,69.15 | R14.1 13.3,80.8 12.57,81.52 12.57,84.5 13.92,85.84 15.34,85.84 15.54,86.04 15.54,88.1 LCD1.2
  Bottom 0.508: VCC.P$1 VCC.P$2 VCC.P$3

### Text on the board
tPlace: Arjinno Mega328 Micro-Computer | Juno V2 | LCD RS pin to digital pin 7 / LCD Enable to digital pin 6 / LCD D4 pin to digital pin 5 / LCD D5 pin to digital pin 4 / LCD D6 pin to digital pin 3 / LCD D7 pin to digital pin 2 / LCD Backlight digital Pin 0 | Juno V2 (2015-May-12) / / Design in San Francisco / Flyandance / JZ | 13 | 12 | 11 | 10 | 9 | 8 | + | A7 | Reset | 5V | MOSI | GND | RST | MISO | SCK | 16m | CPU | 12m | CH340G | Atmega328 | GND | 5V | SCL | SDA | A6 | A7 | A6 | A5 | A4 | A3 | 8 | ~ | 9 | 10 | ~ | 11 | ~ | 12 | 13 | A2 | A1 | A0 | 1 | Analog Pin | Digital Pin
200bmp: C:/Users/Jin/Desktop/PCB/logo.bmp
202bmp: C:/Users/Jin/Desktop/PCB/V2.bmp